# EAGLE design Plant friends capsensor (EAGLE 6.6.0)
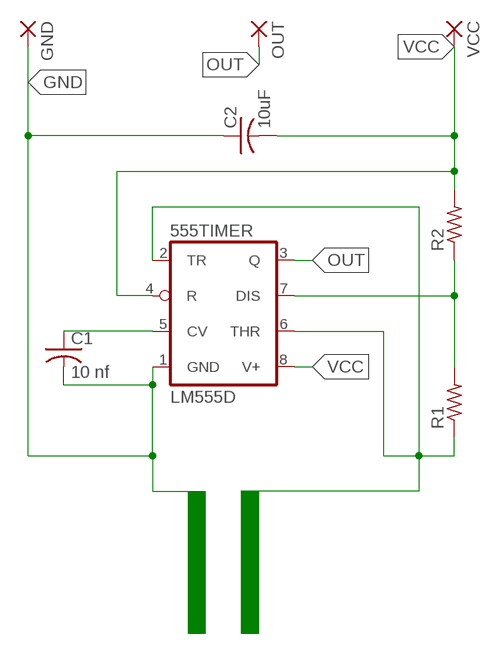
[diagram p0: schematic, sheet 1]

## Parts
555TIMER  LM555D  [SO08]
C1  10 nf  C-USC0805  [C0805]
C2  10uF  C-USC0805  [C0805]
GND  WIREPAD2,54/1,0  [2,54/1,0]
OUT  WIREPAD2,54/1,0  [2,54/1,0]
R1  R-US_R0805  [R0805]
R2  R-US_R0805  [R0805]
VCC  WIREPAD2,54/1,0  [2,54/1,0]

## Nets
C: 555TIMER.2(TR) 555TIMER.6(THR) R1.1
GND: 555TIMER.1(GND) C1.2 C2.1 GND.1(P)
N$3: 555TIMER.7(DIS) R1.2 R2.1
N$6: 555TIMER.5(CV) C1.1
OUT: 555TIMER.3(Q) OUT.1(P)
VCC: 555TIMER.4(R) 555TIMER.8(V+) C2.2 R2.2 VCC.1(P)

## Library data of the parts
555TIMER = adafruit:*555: TIMER Changed DIP package to have round (not oval) pin pads http://www.ladyada.net/library/pcb/eaglelibrary.html
C1 C2 = adafruit:C-US: CAPACITOR, American symbol
GND OUT VCC = wirepad:WIREPAD: Wire PAD connect wire on PCB
R1 R2 = adafruit:R-US_: RESISTOR, American symbol

## Board
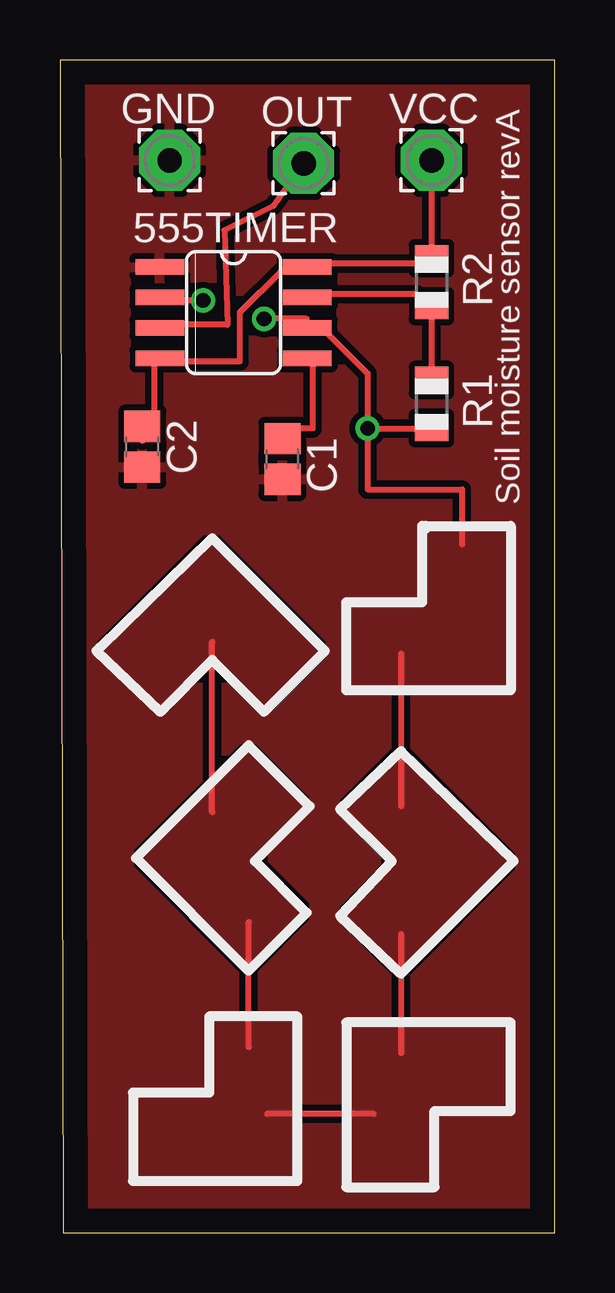
[diagram p1: board, top side]
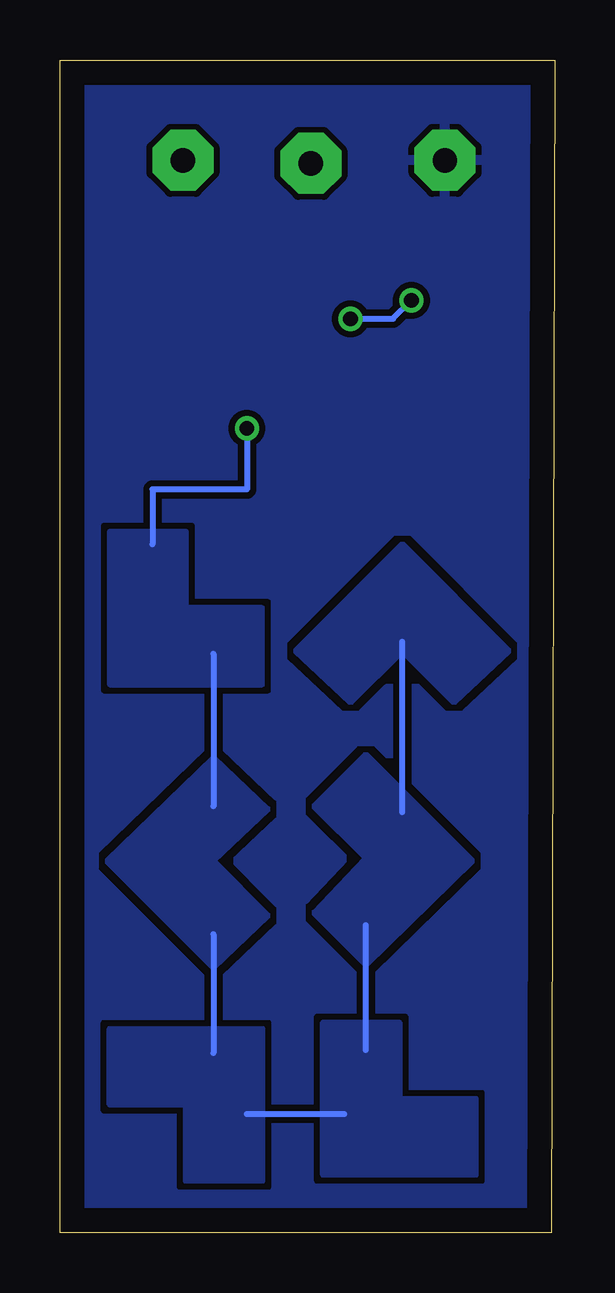
[diagram p2: board, bottom side, seen from below]

Size 20.62 x 48.88 mm. Coordinates in mm from the lower left corner, seen from the top.
Outline: 0.13,0 20.62,0 20.62,48.88 0,48.88 0.13,0
Copper layers (1*16): Top 0.035mm / dielectric 1.5mm / Bottom 0.035mm
Design rules "default": minimum track width 10mil, minimum drill 24mil, track to track 8mil, track to pad 8mil, pad to pad 8mil, via to via 8mil, smd to smd 8mil, copper to edge 40mil, drill to drill 8mil, minimum pad ring 10mil, minimum via ring 8mil, stop-mask expansion 4mil, vias tented up to drill 0mil, thermal gap 10mil

### Footprints (pad centres in the part's own frame; a part is rotated, then mirrored left to right if it is on the bottom)
SO08 = smd 0.66 x 2.032: 1 -1.905,-3.073; 2 -0.635,-3.073; 3 0.635,-3.073; 4 1.905,-3.073; 5 1.905,3.073; 6 0.635,3.073; 7 -0.635,3.073; 8 -1.905,3.073
C0805 = smd 1.3 x 1.5: 1 -0.85,0; 2 0.85,0
2,54/1,0 = drill 1.016 pad 2.54 octagon: 1 0,0
R0805 = smd 1.1 x 1.4: 1 -1,0; 2 1,0

### Placement (x,y rotation side)
555TIMER  7.24,38.35 270 top
C1  9.27,32.26 270 top
C2  3.43,32.77 90 top
GND  4.57,44.7 0 top
OUT  10.16,44.58 0 top
R1  15.49,34.54 90 top
R2  15.49,39.62 90 top
VCC  15.49,44.7 0 top

### Tracks (layer width: path | path; a pad name or v marks a point on that pad's centre or on a via)
C  (via drill 0.6, 0.61)
  Top 0.254: v12.83,33.53 14.86,33.53 R1.1 | v12.83,33.53 12.83,35.81 11.05,37.59 10.54,37.59 555TIMER.6 10.29,37.85 10.29,38.1 v8.51,38.1 | 555TIMER.2 4.19,38.86 v5.97,38.86 | v12.83,33.53 12.83,30.99 16.76,30.99 16.76,28.7 | 14.22,24.13 14.22,17.78 | 14.22,12.45 14.22,7.49 | 6.35,17.53 6.35,24.64 | 7.87,7.75 7.87,12.95 | 13.08,4.95 8.64,4.95
  Bottom 0.254: v5.97,38.86 6.73,38.1 v8.51,38.1 | v12.83,33.53 12.83,30.99 16.76,30.99 16.76,28.7 | 14.22,24.13 14.22,17.78 | 14.22,12.45 14.22,7.49 | 12.83,4.95 8.76,4.95 | 7.87,7.62 7.87,12.83 | 6.35,17.53 6.35,24.64
  pour Top (isolate 0.254): 18.54,29.21 18.54,22.86 12.19,22.86 12.19,26.04 15.37,26.04 15.37,29.21
  pour Top (isolate 0.254): 14.22,19.89 18.64,15.47 14.22,11.05 12.01,13.26 14.22,15.47 12.01,17.68
  pour Top (isolate 0.254): 18.54,8.51 12.19,8.51 12.19,2.16 15.37,2.16 15.37,5.33 18.54,5.33
  pour Top (isolate 0.254): 9.65,8.76 9.65,2.41 3.3,2.41 3.3,5.59 6.48,5.59 6.48,8.76
  pour Top (isolate 0.254): 7.85,20.02 3.43,15.6 7.85,11.18 10.06,13.39 7.85,15.6 10.06,17.81
  pour Top (isolate 0.254): 1.91,24.31 6.32,28.73 10.74,24.31 8.53,22.1 6.32,24.31 4.24,22.1
  pour Bottom (isolate 0.254): 18.54,29.21 18.54,22.86 12.19,22.86 12.19,26.04 15.37,26.04 15.37,29.21
  pour Bottom (isolate 0.254): 11.94,17.65 14.22,19.81 18.67,15.49 14.22,11.05 11.94,13.21 14.22,15.49
  pour Bottom: 12.19,2.16 15.37,2.16 15.37,5.33 18.54,5.33 18.54,8.51 12.19,8.51
  pour Bottom (isolate 0.254): 1.91,24.26 4.19,22.1 6.35,24.26 8.51,22.1 10.79,24.26 6.35,28.7
  pour Bottom: 7.87,11.18 10.03,13.34 7.87,15.62 10.03,17.78 7.87,19.94 3.43,15.49
  pour Bottom (isolate 0.254): 3.3,2.41 9.65,2.41 9.65,8.76 6.48,8.76 6.48,5.59 3.3,5.59
GND
  pour Bottom (isolate 0.254, rank 2): -0.38,50.29 21.08,49.91 21.59,-0.76 -0.64,-0.51
  pour Top (isolate 0.254, rank 6): -0.89,50.42 20.7,50.16 20.95,-0.64 -0.89,-0.38
N$3
  Top 0.254: R1.2 R2.1 14.86,39.12 10.54,39.12 555TIMER.7
N$6
  Top 0.254: C1.1 9.27,33.53 10.54,33.53 10.54,36.32 555TIMER.5
OUT
  Top 0.254: OUT.1 8.89,42.8 6.86,41.78 6.98,37.85 4.19,37.85 555TIMER.3
VCC
  Top 0.254: C2.2 3.43,33.02 3.94,33.53 3.94,36.32 555TIMER.4 4.19,36.32 7.49,36.32 7.49,38.35 9.27,40.13 10.29,40.13 555TIMER.8 10.79,40.39 15.11,40.39 R2.2 VCC.1

### Text on the board
tPlace: Soil moisture sensor revA